# EAGLE schematic Solar panel(without ATmega328p) (EAGLE 9.6.0)
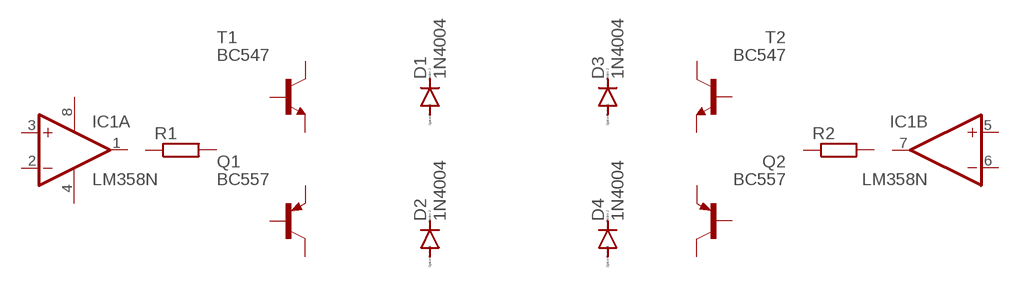
[diagram p0: schematic, sheet 1]

## Parts
D1  1N4004  [DO41-10]
D2  1N4004  [DO41-10]
D3  1N4004  [DO41-10]
D4  1N4004  [DO41-10]
IC1  LM358N  [DIL08]
Q1  BC557  [TO92]
Q2  BC557  [TO92]
R1  R-EU_0204/7  [0204/7]
R2  R-EU_0204/7  [0204/7]
T1  BC547  [TO92]
T2  BC547  [TO92]
Unconnected: D1.A D1.C D2.A D2.C D3.A D3.C D4.A D4.C IC1.1(A:OUT) IC1.2(A:-IN) IC1.3(A:+IN) IC1.5(B:+IN) IC1.6(B:-IN) IC1.7(B:OUT) Q1.1(E) Q1.2(B) Q1.3(C) Q2.1(E) Q2.2(B) Q2.3(C) R1.1 R1.2 R2.1 R2.2 T1.1(E) T1.2(B) T1.3(C) T2.1(E) T2.2(B) T2.3(C)

## Power pins joined to a net without a drawn wire
V+: IC1.8(P:V+)
V-: IC1.4(P:V-)

## Library data of the parts
D1-D4 = diode:1N4004: DIODE general purpose rectifier, 1 A
IC1 = linear:LM358: OP AMP also LM158; LM258; LM2904 Source: http://cache.national.com/ds/LM/LM158.pdf
Q1 Q2 = transistor-pnp:BC557: PNP Transistor
R1 R2 = rcl:R-EU_: RESISTOR, European symbol; SPICEPREFIX: R
T1 T2 = transistor:BC547: NPN TRANSISTOR